# Altium schematic sheet Sheet1.SchDoc
size A4
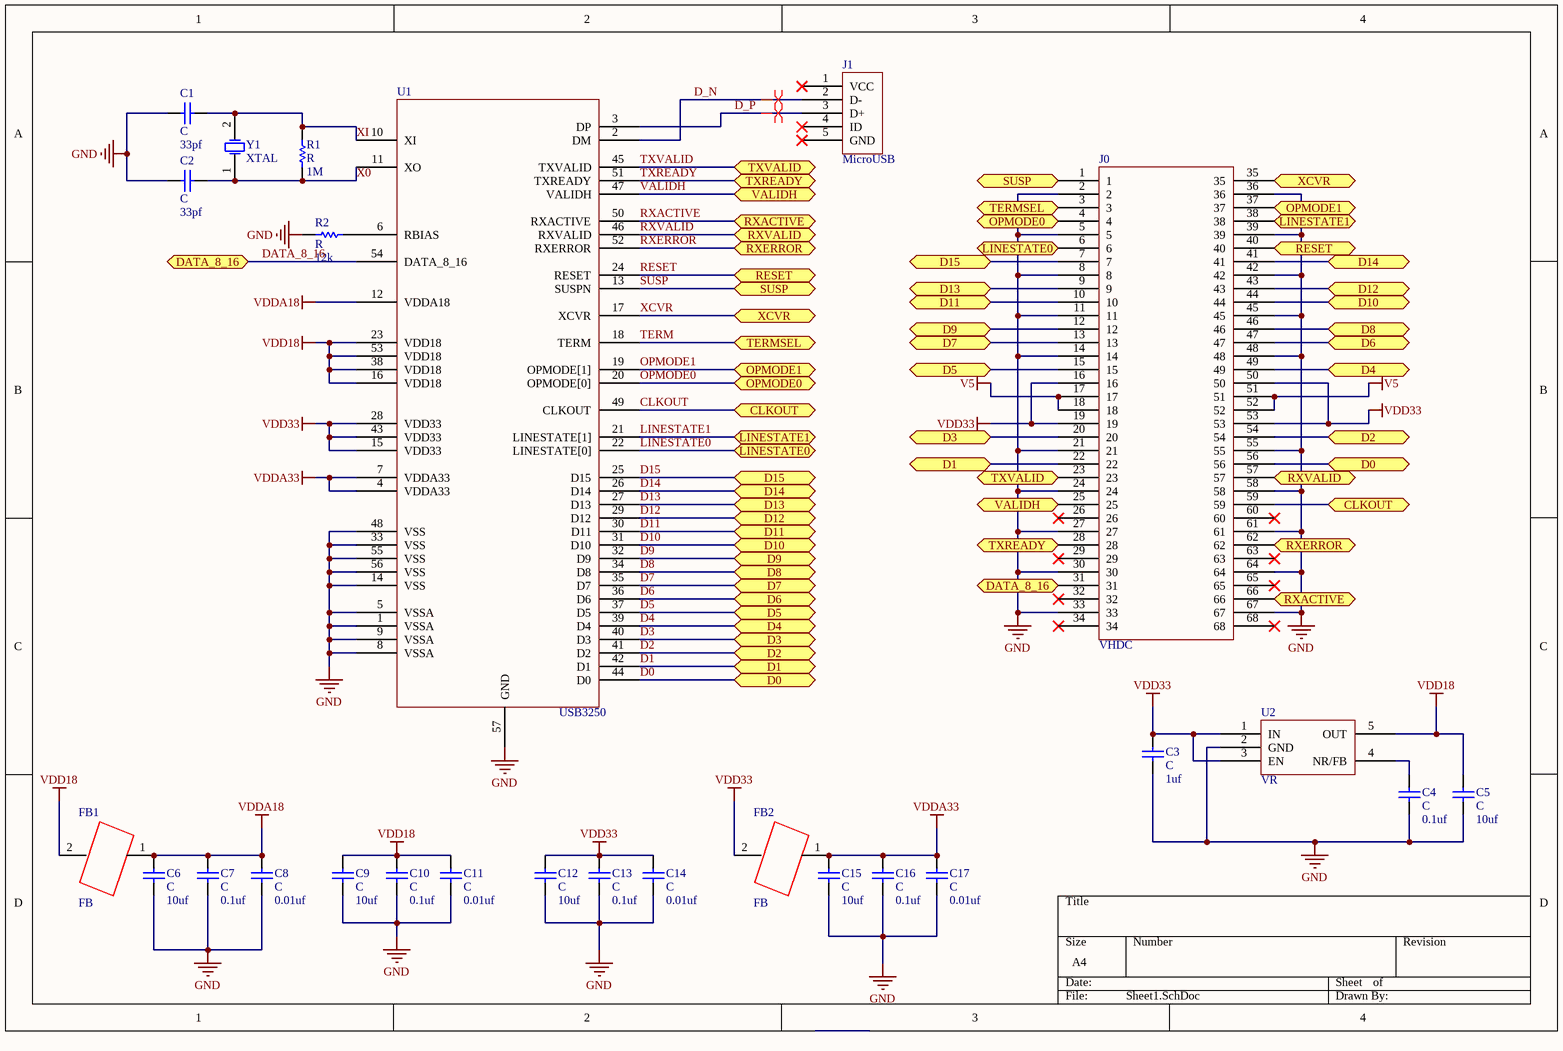
[diagram p0: Sheet1.SchDoc]

## Parts
C1  C  value 33pf  [1608[0603]]
C2  C  value 33pf  [1608[0603]]
C3  C  value 1uf  [1608[0603]]
C4  C  value 0.1uf  [1608[0603]]
C5  C  value 10uf  [6-0805_L]
C6  C  value 10uf  [6-0805_L]
C7  C  value 0.1uf  [1608[0603]]
C8  C  value 0.01uf  [1608[0603]]
C9  C  value 10uf  [6-0805_L]
C10  C  value 0.1uf  [1608[0603]]
C11  C  value 0.01uf  [1608[0603]]
C12  C  value 10uf  [6-0805_L]
C13  C  value 0.1uf  [1608[0603]]
C14  C  value 0.01uf  [1608[0603]]
C15  C  value 10uf  [6-0805_L]
C16  C  value 0.1uf  [1608[0603]]
C17  C  value 0.01uf  [1608[0603]]
FB1  FB  [1608[0603]]
FB2  FB  [1608[0603]]
J0  VHDC  [VHDC]
J1  MicroUSB  [Micro_USB]
R1  R  value 1M  [1608[0603]]
R2  R  value 12k  [1608[0603]]
U1  USB3250  [QFN50P800X800-56VBL]
U2  VR  [SOT23-5BL]
Y1  XTAL  [XST]

## Ports
CLKOUT, D0, D1, D2, D3, D4, D5, D6, D7, D8, D9, D10, D11, D12, D13, D14, D15, DATA_8_16, LINESTATE0, LINESTATE1, OPMODE0, OPMODE1, RESET, RXACTIVE, RXERROR, RXVALID, SUSP, TERMSEL, TXREADY, TXVALID, VALIDH, XCVR

## Nets
GND: C1.1 C2.1 C3.1 C4.1 C5.1 C6.1 C7.1 C8.1 C9.1 C10.1 C11.1 C12.1 C13.1 C14.1 C15.1 C16.1 C17.1 J0.2 J0.5 J0.8 J0.11 J0.14 J0.21 J0.24 J0.27 J0.30 J0.33 J0.36 J0.39 J0.42 J0.45 J0.48 J0.55 J0.58 J0.61 J0.64 J0.67 R2.1 U1.1(VSSA) U1.5(VSSA) U1.8(VSSA) U1.9(VSSA) U1.14(VSS) U1.33(VSS) U1.48(VSS) U1.55(VSS) U1.56(VSS) U1.57(GND) U2.2(GND)
V5: J0.17 J0.18 J0.51 J0.52
VDD18: C5.2 C9.2 C10.2 C11.2 FB1.2 U1.16(VDD18) U1.23(VDD18) U1.38(VDD18) U1.53(VDD18) U2.5(OUT)
VDD33: C3.2 C12.2 C13.2 C14.2 FB2.2 J0.16 J0.19 J0.50 J0.53 U1.15(VDD33) U1.28(VDD33) U1.43(VDD33) U2.1(IN) U2.3(EN)
VDDA18: C6.2 C7.2 C8.2 FB1.1 U1.12(VDDA18)
VDDA33: C15.2 C16.2 C17.2 FB2.1 U1.4(VDDA33) U1.7(VDDA33)
CLKOUT: J0.59 U1.49(CLKOUT) ; port CLKOUT
D0: J0.56 U1.44(D0) ; port D0
D1: J0.22 U1.42(D1) ; port D1
D2: J0.54 U1.41(D2) ; port D2
D3: J0.20 U1.40(D3) ; port D3
D4: J0.49 U1.39(D4) ; port D4
D5: J0.15 U1.37(D5) ; port D5
D6: J0.47 U1.36(D6) ; port D6
D7: J0.13 U1.35(D7) ; port D7
D8: J0.46 U1.34(D8) ; port D8
D9: J0.12 U1.32(D9) ; port D9
D10: J0.44 U1.31(D10) ; port D10
D11: J0.10 U1.30(D11) ; port D11
D12: J0.43 U1.29(D12) ; port D12
D13: J0.9 U1.27(D13) ; port D13
D14: J0.41 U1.26(D14) ; port D14
D15: J0.7 U1.25(D15) ; port D15
D_N: J1.2(D-) U1.2(DM)
D_P: J1.3(D+) U1.3(DP)
DATA_8_16: J0.31 U1.54(DATA_8_16) ; port DATA_8_16
LINESTATE0: J0.6 U1.22(LINESTATE[0]) ; port LINESTATE0
LINESTATE1: J0.38 U1.21(LINESTATE[1]) ; port LINESTATE1
OPMODE0: J0.4 U1.20(OPMODE[0]) ; port OPMODE0
OPMODE1: J0.37 U1.19(OPMODE[1]) ; port OPMODE1
RESET: J0.40 U1.24(RESET) ; port RESET
RXACTIVE: J0.66 U1.50(RXACTIVE) ; port RXACTIVE
RXERROR: J0.62 U1.52(RXERROR) ; port RXERROR
RXVALID: J0.57 U1.46(RXVALID) ; port RXVALID
SUSP: J0.1 U1.13(SUSPN) ; port SUSP
TERM: J0.3 U1.18(TERM) ; port TERMSEL
TXREADY: J0.28 U1.51(TXREADY) ; port TXREADY
TXVALID: J0.23 U1.45(TXVALID) ; port TXVALID
VALIDH: J0.25 U1.47(VALIDH) ; port VALIDH
X0: C2.2 R1.1 U1.11(XO) Y1.1(OSC1)
XCVR: J0.35 U1.17(XCVR) ; port XCVR
XI: C1.2 R1.2 U1.10(XI) Y1.2(OSC2)
NetC4_2: C4.2 U2.4(NR/FB)
NetR2_2: R2.2 U1.6(RBIAS)

Not connected (* = marked no-connect by the designer): J0 26* 29* 32* 34* 60* 63* 65* 68*; J1 1(VCC)* 4(ID)* 5(GND)*

## Layout directives
differential pair: D_N, D_P

## Library data of the parts
C1-C17 = C: Capacitor (Semiconductor SIM Model); Published: 8-Jun-2000; LatestRevisionDate: 29-May-2009; LatestRevisionNote: IPC-7351 Footprint Added.; PackageReference: C1206; Publisher: Altium Limited; PackageDescription: Chip Capacitor
R1 R2 = R: Resistor; Published: 8-Jun-2000; LatestRevisionDate: 17-Jul-2002; LatestRevisionNote: Re-released for DXP Platform.; PackageReference: AXIAL-0.3; Publisher: Altium Limited; PackageDescription: Axial Device, Thru-Hole; 2 Leads; 0.3 in Pin Spacing
Y1 = XTAL: Crystal Oscillator; Published: 8-Jun-2000; LatestRevisionDate: 17-Jul-2002; LatestRevisionNote: Re-released for DXP Platform.; PackageReference: R38; Publisher: Altium Limited; PackageDescription: Crystal, Thru-Hole; 2 Leads; Body 3.1 x 8.2 mm (Dia.xH)